# EAGLE design Wemos-ESP32_MAX7219 v1 (EAGLE 9.6.2)
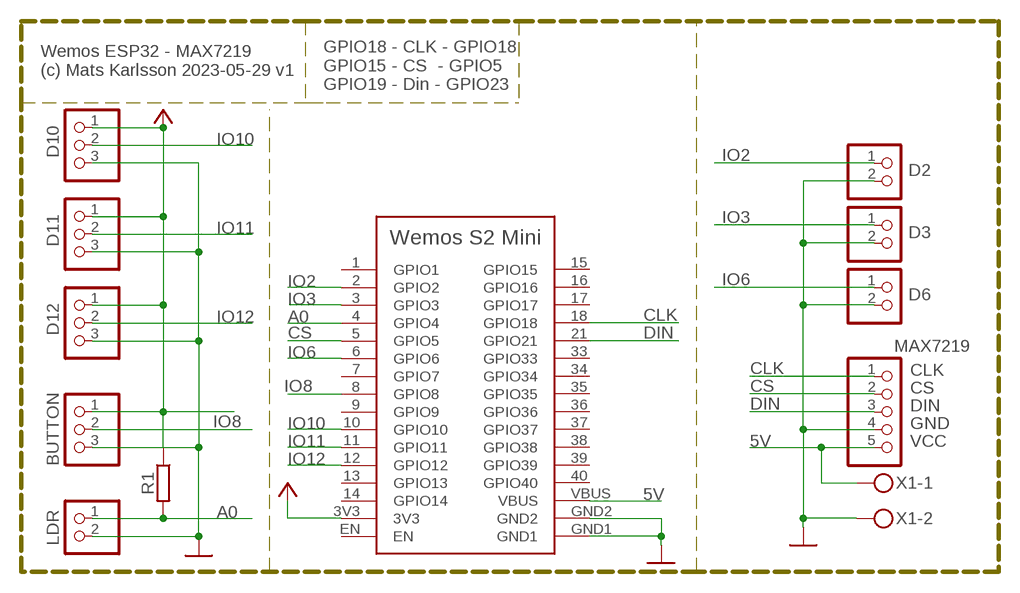
[diagram p0: schematic, sheet 1]

## Parts
BUTTON  PINHD-1X3  [1X03]
D2  PINHD-1X2  [1X02]
D3  PINHD-1X2  [1X02]
D6  PINHD-1X2  [1X02]
D10  PINHD-1X3  [1X03]
D11  PINHD-1X3  [1X03]
D12  PINHD-1X3  [1X03]
LDR  PINHD-1X2  [1X02]
MAX7219  PINHD-1X5  [1X05]
R1  R-EU_M0805  [M0805]
U$1  WEMOS_S2_MINI  [WEMOS_S2_MINI]
X1  W237-102  [W237-102]

## Nets
5V: MAX7219.5 U$1.VBUS X1.1
A0: LDR.1 R1.2 U$1.4(GPIO4)
CLK: MAX7219.1 U$1.18(GPIO18)
CS: MAX7219.2 U$1.5(GPIO5)
DIN: MAX7219.3 U$1.21(GPIO21)
GND: BUTTON.3 D2.2 D3.2 D6.2 D10.3 D11.3 D12.3 LDR.2 MAX7219.4 U$1.GND1 U$1.GND2 X1.2
IO2: D2.1 U$1.2(GPIO2)
IO3: D3.1 U$1.3(GPIO3)
IO6: D6.1 U$1.6(GPIO6)
IO8: BUTTON.2 U$1.8(GPIO8)
IO10: D10.2 U$1.10(GPIO10)
IO11: D11.2 U$1.11(GPIO11)
IO12: D12.2 U$1.12(GPIO12)
VCC: BUTTON.1 D10.1 D11.1 D12.1 R1.1 U$1.3V3
Unconnected: U$1.1(GPIO1) U$1.7(GPIO7) U$1.9(GPIO9) U$1.13(GPIO13) U$1.14(GPIO14) U$1.15(GPIO15) U$1.16(GPIO16) U$1.17(GPIO17) U$1.33(GPIO33) U$1.34(GPIO34) U$1.35(GPIO35) U$1.36(GPIO36) U$1.37(GPIO37) U$1.38(GPIO38) U$1.39(GPIO39) U$1.40(GPIO40) U$1.EN

## Notes on the sheet
- Wemos ESP32 - MAX7219
  (c) Mats Karlsson 2023-05-29 v1
- GPIO18 - CLK - GPIO18
  GPIO15 - CS  - GPIO5
  GPIO19 - Din - GPIO23
- CLK
- CS
- DIN
- GND
- VCC

## Library data of the parts
BUTTON D10-D12 = pinhead:PINHD-1X3: PIN HEADER
D2 D3 D6 LDR = pinhead:PINHD-1X2: PIN HEADER
MAX7219 = pinhead:PINHD-1X5: PIN HEADER
R1 = rcl:R-EU_: RESISTOR, European symbol; SPICEPREFIX: R
U$1 = mk:WEMOS_S2_MINI: Wemos S2 Mini https://www.wemos.cc/en/latest/s2/s2_mini.html
X1 = con-wago-500:W237-102: WAGO SCREW CLAMP; MPN: 237-102; OC_FARNELL: unknown; OC_NEWARK: 70K9898

## Board
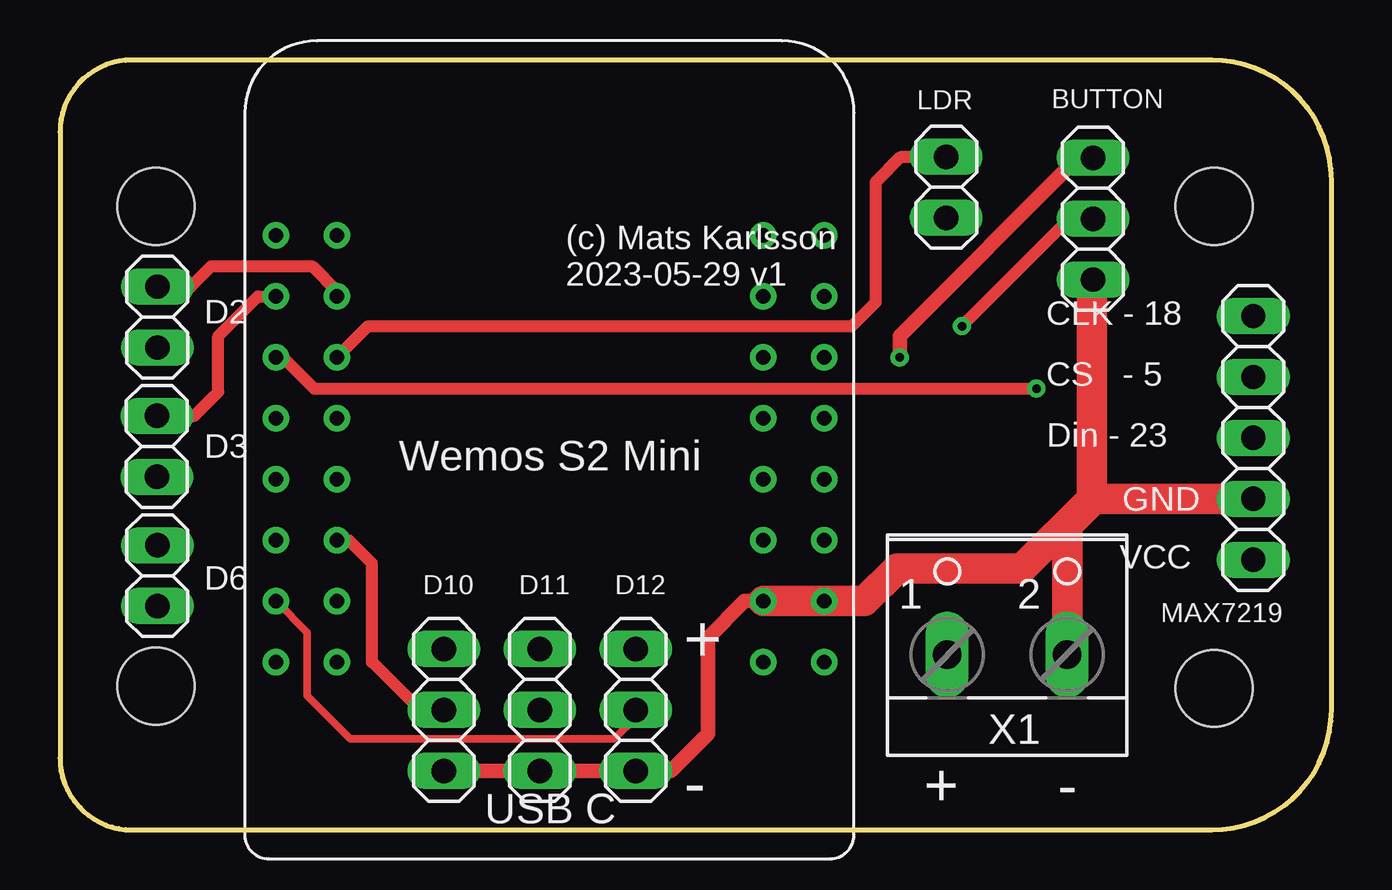
[diagram p1: board, top side]
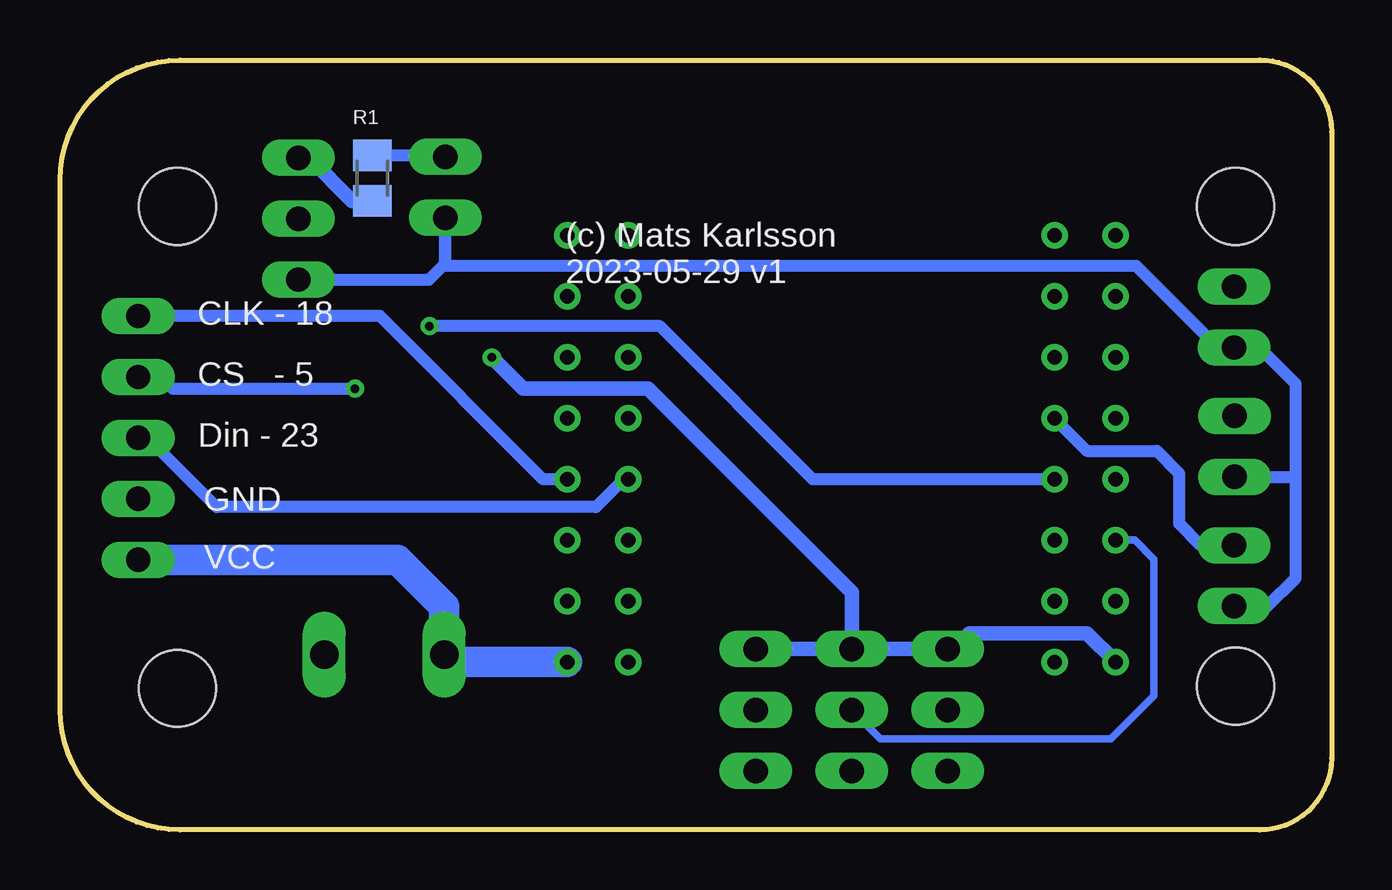
[diagram p2: board, bottom side, seen from below]

Size 53 x 32.1 mm. Coordinates in mm from the lower left corner, seen from the top.
Outline: 3,0 48,0 arc90 53,5 53,27.1 arc90 48,32.1 3,32.1 arc90 0,29.1 0,3 arc90 3,0
Copper layers (1*16): Top 0.035mm / dielectric 1.5mm / Bottom 0.035mm
Design rules "default": minimum track width 6mil, minimum drill 0.35mm, track to track 6mil, track to pad 6mil, pad to pad 6mil, via to via 6mil, smd to smd 6mil, copper to edge 40mil, drill to drill 6mil, minimum pad ring 10mil, minimum via ring 8mil, stop-mask expansion 4mil, vias tented up to drill 0mil, thermal gap 10mil
Holes 3.2 mm at 48.1,5.9 48.1,26 4,26 4,6

### Footprints (pad centres in the part's own frame; a part is rotated, then mirrored left to right if it is on the bottom)
1X03 = drill 1.016 long: 1 -2.54,0; 2 0,0; 3 2.54,0
1X02 = drill 1.016 long: 1 -1.27,0; 2 1.27,0
1X05 = drill 1.016 long: 1 -5.08,0; 2 -2.54,0; 3 0,0; 4 2.54,0; 5 5.08,0
M0805 = smd 1.3 x 1.6: 1 -0.95,0; 2 0.95,0
WEMOS_S2_MINI = drill 0.6: 1 2.54,17.78; 2 2.54,15.24; 3 0,15.24; 3V3 0,0; 4 2.54,12.7; 5 0,12.7; 6 2.54,10.16; 7 0,10.16; 8 2.54,7.62; 9 0,7.62; 10 2.54,5.08; 11 0,5.08; 12 0,2.54; 13 2.54,2.54; 14 2.54,0; 15 20.32,0; 16 22.86,5.08; 17 20.32,5.08; 18 22.86,7.62; 21 20.32,7.62; 33 22.86,10.16; 34 20.32,10.16; 35 22.86,12.7; 36 20.32,12.7; 37 22.86,15.24; 38 20.32,15.24; 39 22.86,17.78; 40 20.32,17.78; EN 0,17.78; GND1 20.32,2.54; GND2 22.86,2.54; VBUS 22.86,0
W237-102 = drill 1.194 long: 1 -2.5,-1.27; 2 2.5,-1.27

### Placement (x,y rotation side)
BUTTON  43.06,25.48 270 top
D2  4.06,21.38 270 top
D3  4.04,15.99 270 top
D6  4.06,10.6 270 top
D10  16,5 270 top
D11  20,5 270 top
D12  24,5 270 top
LDR  36.94,26.79 270 top
MAX7219  49.74,16.34 270 top
R1  39.98,27.17 90 bottom
U$1  9,7 0 top
X1  39.48,8.57 0 top

### Tracks (layer width: path | path; a pad name or v marks a point on that pad's centre or on a via)
5V
  Bottom 0.508: 36.68,7 X1.1
  Bottom 1.27: X1.1 36.98,9.32 38.92,11.26 MAX7219.5 | U$1.VBUS 36.68,7
A0
  Top 0.508: U$1.4 12.84,21 33,21 34,22 34,27 35.06,28.06 LDR.1
  Bottom 0.508: R1.2 37,28.12 LDR.1
CLK
  Bottom 0.508: U$1.18 32.86,14.62 39.66,21.42 MAX7219.1
CS  (via drill 0.35)
  Top 0.508: U$1.5 9.3,19.7 10.6,18.4 v40.7,18.4
  Bottom 0.508: v40.7,18.4 48.3,18.4 48.78,18.88 MAX7219.2
DIN
  Bottom 0.508: U$1.21 29.5,14.62 30.66,13.46 46.46,13.46 49.34,16.34 MAX7219.3
GND
  Top 0.508: BUTTON.3 43,22.88
  Top 0.61: D10.3 D11.3 D12.3 25.46,2.46 27,4 27,8 28.54,9.54 U$1.GND1
  Top 1.27: 43,13.8 MAX7219.4 43.1,13.8 41.98,12.69 X1.2 | 43,13.8 40.1,10.9 34.9,10.9 33.54,9.54 U$1.GND2 U$1.GND1 | 43,22.88 43,13.8
  Bottom 0.508: 43,22.88 BUTTON.3 37.62,22.94 36.94,23.62 LDR.2 36.94,23.52 8.15,23.52 4.74,20.11 D2.2 3.95,20 2.9,20 1.5,18.6 1.5,14.8 | D6.2 2.67,9.33 1.5,10.5 1.5,14.8 | D3.2 1.58,14.72 1.5,14.8
IO2
  Top 0.508: D2.1 5.45,22.65 6.3,23.5 10.5,23.5 11.54,22.46 U$1.2
IO3
  Top 0.508: D3.1 5.6,17.26 6.6,18.26 6.6,20.6 8.24,22.24 U$1.3
IO6
  Bottom 0.508: D6.1 5.46,11.87 6.36,12.77 6.36,14.87 7.29,15.8 10.2,15.8 11.54,17.14 U$1.6
IO8  (via drill 0.35)
  Top 0.508: v37.6,21 42.08,25.48 BUTTON.2
  Bottom 0.508: U$1.8 21.62,14.62 28,21 v37.6,21
IO10
  Top 0.508: D10.2 15,5 13,7 13,11.12 12.04,12.08 U$1.10
IO11
  Bottom 0.305: U$1.11 8.2,12.08 7.4,11.28 7.4,5.6 9.2,3.8 18.8,3.8 D11.2
IO12
  Top 0.305: U$1.12 10.3,8.24 10.3,5.6 12.1,3.8 23.1,3.8 24,4.7 D12.2
VCC  (via drill 0.35)
  Top 0.508: 43.04,28 42.4,28
  Top 0.61: BUTTON.1 43.04,28 | 42.4,28 35,20.6 v35,19.7
  Bottom 0.508: D10.1 15.76,7.54
  Bottom 0.61: D10.1 D11.1 | D11.1 D12.1 | 15.76,7.54 15.1,8.2 10.2,8.2 U$1.3V3 | R1.1 40.82,26.22 42.62,28.02 BUTTON.1 | v35,19.7 33.7,18.4 28.5,18.4 20,9.9 D11.1

### Text on the board
tNames: (c) Mats Karlsson / 2023-05-29 v1 | D2 | CLK - 18 | CS - 5 | Din - 23 | D3 | GND | VCC | D6 | + | - | + -
bNames: (c) Mats Karlsson / 2023-05-29 v1 | CLK - 18 | CS - 5 | Din - 23 | GND | VCC
tValues: - | +
Document: CLK GPIO18 / CS GPIO5 / DIN GPIO23 / GND / VCC